# Altium schematic sheet my.SchDoc
size A3; Organization: Altium Limited; Address1: L3, 12a Rodborough Rd; Address2: Frenchs Forest; Address3: NSW; Address4: Australia 2086
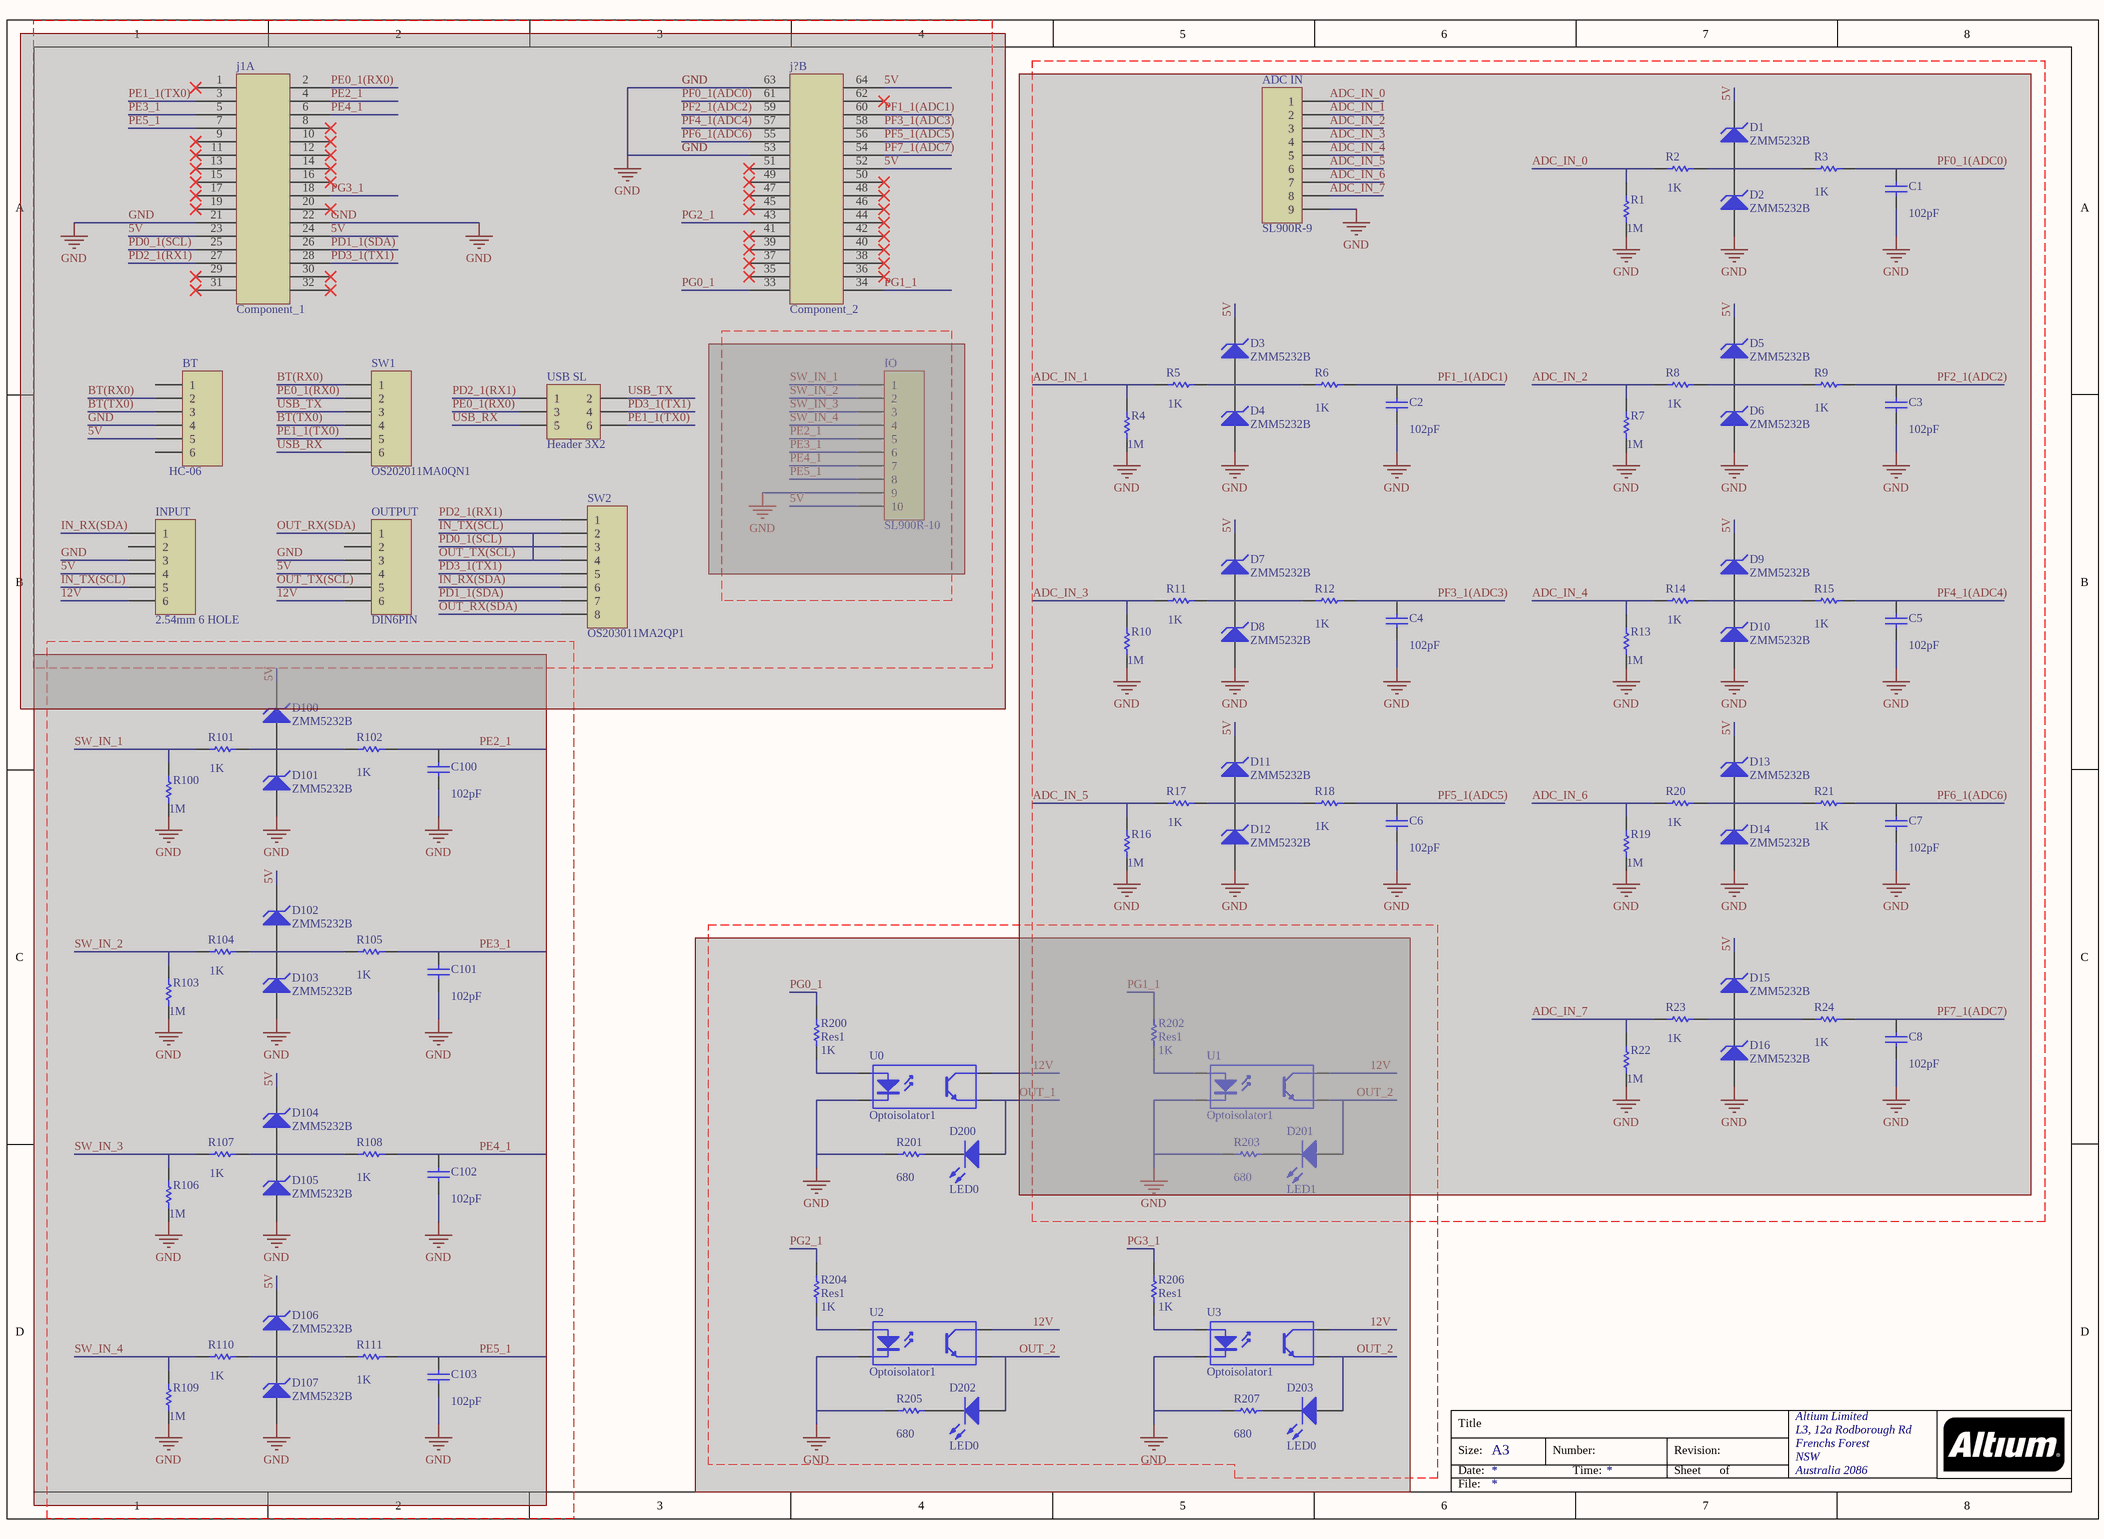
[diagram p0: my.SchDoc]

## Parts
ADC_IN  SL900R-9  [SR-900R-9]  (masked out: inside a compile mask, not in the netlist)
BT  HC-06  [HC-06]  (masked out: inside a compile mask, not in the netlist)
C1  value 102pF  [CAP103]  (hidden comment: Cap)  (masked out: inside a compile mask, not in the netlist)
C2  value 102pF  [CAP103]  (hidden comment: Cap)  (masked out: inside a compile mask, not in the netlist)
C3  value 102pF  [CAP103]  (hidden comment: Cap)  (masked out: inside a compile mask, not in the netlist)
C4  value 102pF  [CAP103]  (hidden comment: Cap)  (masked out: inside a compile mask, not in the netlist)
C5  value 102pF  [CAP103]  (hidden comment: Cap)  (masked out: inside a compile mask, not in the netlist)
C6  value 102pF  [CAP103]  (hidden comment: Cap)  (masked out: inside a compile mask, not in the netlist)
C7  value 102pF  [CAP103]  (hidden comment: Cap)  (masked out: inside a compile mask, not in the netlist)
C8  value 102pF  [CAP103]  (hidden comment: Cap)  (masked out: inside a compile mask, not in the netlist)
C100  value 102pF  [CAP103]  (hidden comment: Cap)  (masked out: inside a compile mask, not in the netlist)
C101  value 102pF  [CAP103]  (hidden comment: Cap)  (masked out: inside a compile mask, not in the netlist)
C102  value 102pF  [CAP103]  (hidden comment: Cap)  (masked out: inside a compile mask, not in the netlist)
C103  value 102pF  [CAP103]  (hidden comment: Cap)  (masked out: inside a compile mask, not in the netlist)
D1  ZMM5232B  [ZMM5232B]  (masked out: inside a compile mask, not in the netlist)
D2  ZMM5232B  [ZMM5232B]  (masked out: inside a compile mask, not in the netlist)
D3  ZMM5232B  [ZMM5232B]  (masked out: inside a compile mask, not in the netlist)
D4  ZMM5232B  [ZMM5232B]  (masked out: inside a compile mask, not in the netlist)
D5  ZMM5232B  [ZMM5232B]  (masked out: inside a compile mask, not in the netlist)
D6  ZMM5232B  [ZMM5232B]  (masked out: inside a compile mask, not in the netlist)
D7  ZMM5232B  [ZMM5232B]  (masked out: inside a compile mask, not in the netlist)
D8  ZMM5232B  [ZMM5232B]  (masked out: inside a compile mask, not in the netlist)
D9  ZMM5232B  [ZMM5232B]  (masked out: inside a compile mask, not in the netlist)
D10  ZMM5232B  [ZMM5232B]  (masked out: inside a compile mask, not in the netlist)
D11  ZMM5232B  [ZMM5232B]  (masked out: inside a compile mask, not in the netlist)
D12  ZMM5232B  [ZMM5232B]  (masked out: inside a compile mask, not in the netlist)
D13  ZMM5232B  [ZMM5232B]  (masked out: inside a compile mask, not in the netlist)
D14  ZMM5232B  [ZMM5232B]  (masked out: inside a compile mask, not in the netlist)
D15  ZMM5232B  [ZMM5232B]  (masked out: inside a compile mask, not in the netlist)
D16  ZMM5232B  [ZMM5232B]  (masked out: inside a compile mask, not in the netlist)
D100  ZMM5232B  [ZMM5232B]  (masked out: inside a compile mask, not in the netlist)
D101  ZMM5232B  [ZMM5232B]  (masked out: inside a compile mask, not in the netlist)
D102  ZMM5232B  [ZMM5232B]  (masked out: inside a compile mask, not in the netlist)
D103  ZMM5232B  [ZMM5232B]  (masked out: inside a compile mask, not in the netlist)
D104  ZMM5232B  [ZMM5232B]  (masked out: inside a compile mask, not in the netlist)
D105  ZMM5232B  [ZMM5232B]  (masked out: inside a compile mask, not in the netlist)
D106  ZMM5232B  [ZMM5232B]  (masked out: inside a compile mask, not in the netlist)
D107  ZMM5232B  [ZMM5232B]  (masked out: inside a compile mask, not in the netlist)
D200  LED0  [LED-0]  (masked out: inside a compile mask, not in the netlist)
D201  LED1  [LED-0]  (masked out: inside a compile mask, not in the netlist)
D202  LED0  [LED-0]  (masked out: inside a compile mask, not in the netlist)
D203  LED0  [LED-0]  (masked out: inside a compile mask, not in the netlist)
INPUT  2.54mm 6 HOLE  [SMW200-06]  (masked out: inside a compile mask, not in the netlist)
IO  SL900R-10  [SR-900R-10]  (masked out: inside a compile mask, not in the netlist)
j1  Component_1  [Component_1]  (part A of 2)  (masked out: inside a compile mask, not in the netlist)
j?  Component_2  [Component_2]  (part B of 2)  (masked out: inside a compile mask, not in the netlist)
OUTPUT  DIN6PIN  [TAIT-MDS-508B6L_V]  (masked out: inside a compile mask, not in the netlist)
R1  value 1M  [R1/4W]  (hidden comment: Res1)  (masked out: inside a compile mask, not in the netlist)
R2  value 1K  [R1/4W]  (hidden comment: Res1)  (masked out: inside a compile mask, not in the netlist)
R3  value 1K  [R1/4W]  (hidden comment: Res1)  (masked out: inside a compile mask, not in the netlist)
R4  value 1M  [R1/4W]  (hidden comment: Res1)  (masked out: inside a compile mask, not in the netlist)
R5  value 1K  [R1/4W]  (hidden comment: Res1)  (masked out: inside a compile mask, not in the netlist)
R6  value 1K  [R1/4W]  (hidden comment: Res1)  (masked out: inside a compile mask, not in the netlist)
R7  value 1M  [R1/4W]  (hidden comment: Res1)  (masked out: inside a compile mask, not in the netlist)
R8  value 1K  [R1/4W]  (hidden comment: Res1)  (masked out: inside a compile mask, not in the netlist)
R9  value 1K  [R1/4W]  (hidden comment: Res1)  (masked out: inside a compile mask, not in the netlist)
R10  value 1M  [R1/4W]  (hidden comment: Res1)  (masked out: inside a compile mask, not in the netlist)
R11  value 1K  [R1/4W]  (hidden comment: Res1)  (masked out: inside a compile mask, not in the netlist)
R12  value 1K  [R1/4W]  (hidden comment: Res1)  (masked out: inside a compile mask, not in the netlist)
R13  value 1M  [R1/4W]  (hidden comment: Res1)  (masked out: inside a compile mask, not in the netlist)
R14  value 1K  [R1/4W]  (hidden comment: Res1)  (masked out: inside a compile mask, not in the netlist)
R15  value 1K  [R1/4W]  (hidden comment: Res1)  (masked out: inside a compile mask, not in the netlist)
R16  value 1M  [R1/4W]  (hidden comment: Res1)  (masked out: inside a compile mask, not in the netlist)
R17  value 1K  [R1/4W]  (hidden comment: Res1)  (masked out: inside a compile mask, not in the netlist)
R18  value 1K  [R1/4W]  (hidden comment: Res1)  (masked out: inside a compile mask, not in the netlist)
R19  value 1M  [R1/4W]  (hidden comment: Res1)  (masked out: inside a compile mask, not in the netlist)
R20  value 1K  [R1/4W]  (hidden comment: Res1)  (masked out: inside a compile mask, not in the netlist)
R21  value 1K  [R1/4W]  (hidden comment: Res1)  (masked out: inside a compile mask, not in the netlist)
R22  value 1M  [R1/4W]  (hidden comment: Res1)  (masked out: inside a compile mask, not in the netlist)
R23  value 1K  [R1/4W]  (hidden comment: Res1)  (masked out: inside a compile mask, not in the netlist)
R24  value 1K  [R1/4W]  (hidden comment: Res1)  (masked out: inside a compile mask, not in the netlist)
R100  value 1M  [R1/4W]  (hidden comment: Res1)  (masked out: inside a compile mask, not in the netlist)
R101  value 1K  [R1/4W]  (hidden comment: Res1)  (masked out: inside a compile mask, not in the netlist)
R102  value 1K  [R1/4W]  (hidden comment: Res1)  (masked out: inside a compile mask, not in the netlist)
R103  value 1M  [R1/4W]  (hidden comment: Res1)  (masked out: inside a compile mask, not in the netlist)
R104  value 1K  [R1/4W]  (hidden comment: Res1)  (masked out: inside a compile mask, not in the netlist)
R105  value 1K  [R1/4W]  (hidden comment: Res1)  (masked out: inside a compile mask, not in the netlist)
R106  value 1M  [R1/4W]  (hidden comment: Res1)  (masked out: inside a compile mask, not in the netlist)
R107  value 1K  [R1/4W]  (hidden comment: Res1)  (masked out: inside a compile mask, not in the netlist)
R108  value 1K  [R1/4W]  (hidden comment: Res1)  (masked out: inside a compile mask, not in the netlist)
R109  value 1M  [R1/4W]  (hidden comment: Res1)  (masked out: inside a compile mask, not in the netlist)
R110  value 1K  [R1/4W]  (hidden comment: Res1)  (masked out: inside a compile mask, not in the netlist)
R111  value 1K  [R1/4W]  (hidden comment: Res1)  (masked out: inside a compile mask, not in the netlist)
R200  Res1  value 1K  [AXIAL-0.3]  (masked out: inside a compile mask, not in the netlist)
R201  value 680  [AXIAL-0.3]  (hidden comment: Res1)  (masked out: inside a compile mask, not in the netlist)
R202  Res1  value 1K  [AXIAL-0.3]  (masked out: inside a compile mask, not in the netlist)
R203  value 680  [AXIAL-0.3]  (hidden comment: Res1)  (masked out: inside a compile mask, not in the netlist)
R204  Res1  value 1K  [AXIAL-0.3]  (masked out: inside a compile mask, not in the netlist)
R205  value 680  [AXIAL-0.3]  (hidden comment: Res1)  (masked out: inside a compile mask, not in the netlist)
R206  Res1  value 1K  [AXIAL-0.3]  (masked out: inside a compile mask, not in the netlist)
R207  value 680  [AXIAL-0.3]  (hidden comment: Res1)  (masked out: inside a compile mask, not in the netlist)
SW1  OS202011MA0QN1  [OS202011MA0QN1]  (masked out: inside a compile mask, not in the netlist)
SW2  OS203011MA2QP1  [OS203011MA2QP1]  (masked out: inside a compile mask, not in the netlist)
U0  Optoisolator1  [DIP-4]  (masked out: inside a compile mask, not in the netlist)
U1  Optoisolator1  [DIP-4]  (masked out: inside a compile mask, not in the netlist)
U2  Optoisolator1  [DIP-4]  (masked out: inside a compile mask, not in the netlist)
U3  Optoisolator1  [DIP-4]  (masked out: inside a compile mask, not in the netlist)
USB_SL  Header 3X2  [USB SEL]  (masked out: inside a compile mask, not in the netlist)

## Notes on the sheet
- Title
- Size:
- Date:
- A3
- Number:
- Time:
- Revision:
- Sheet
- of
- File:

## Library data of the parts
ADC_IN = Header 9: Header, 9-Pin; LatestRevisionDate: 17-Jul-2002; LatestRevisionNote: Re-released for DXP Platform.; Publisher: Altium Limited
BT INPUT OUTPUT SW1 = Header 6: Header, 6-Pin; LatestRevisionDate: 17-Jul-2002; LatestRevisionNote: Re-released for DXP Platform.; Publisher: Altium Limited
C1-C8 C100-C103 = Cap: Capacitor; Published: 8-Jun-2000; LatestRevisionDate: 17-Jul-2002; LatestRevisionNote: Re-released for DXP Platform.; PackageReference: RAD-0.3; Publisher: Altium Limited; PackageDescription: Radial Cap, Thru-Hole; 2 Leads; 0.3 in Pin Spacing
D1-D16 D100-D107 = D Zener: Zener Diode; Published: 8-Jun-2000; LatestRevisionDate: 17-Jul-2002; LatestRevisionNote: Re-released for DXP Platform.; PackageReference: DIODE-0.7; Publisher: Altium Limited; PackageDescription: Diode, Thru-Hole; 2 Leads; 0.7 in Pin Spacing
D200-D203 = LED0: Typical INFRARED GaAs LED; Published: 8-Jun-2000; LatestRevisionDate: 08-Jul-2005; LatestRevisionNote: Mech Layer 1 removed.; PackageReference: LED-0; Publisher: Altium Limited; PackageDescription: LED; 2 Leads
IO = Header 10: Header, 10-Pin; LatestRevisionDate: 17-Jul-2002; LatestRevisionNote: Re-released for DXP Platform.; Publisher: Altium Limited
j? = Component_1
R1-R24 R100-R111 R200-R207 = Res1: Resistor; Published: 8-Jun-2000; LatestRevisionDate: 17-Jul-2002; LatestRevisionNote: Re-released for DXP Platform.; PackageReference: AXIAL-0.3; Publisher: Altium Limited; PackageDescription: Axial Device, Thru-Hole; 2 Leads; 0.3 in Pin Spacing
SW2 = Header 8: Header, 8-Pin; LatestRevisionDate: 17-Jul-2002; LatestRevisionNote: Re-released for DXP Platform.; Publisher: Altium Limited
U0-U3 = Optoisolator1: 4-Pin Phototransistor Optocoupler; Published: 24-Mar-1999; LatestRevisionDate: 04-Mar-2005; LatestRevisionNote: Sch pins 3 & 4 Swapped.; DatasheetVersion: Nov-2003; PackageReference: DIP-4; Publisher: Altium Limited
USB_SL = Header 3X2: Header, 3-Pin, Dual row; LatestRevisionDate: 17-Jul-2002; LatestRevisionNote: Re-released for DXP Platform.; Publisher: Altium Limited